# Altium project MXT2088.PrjPcb
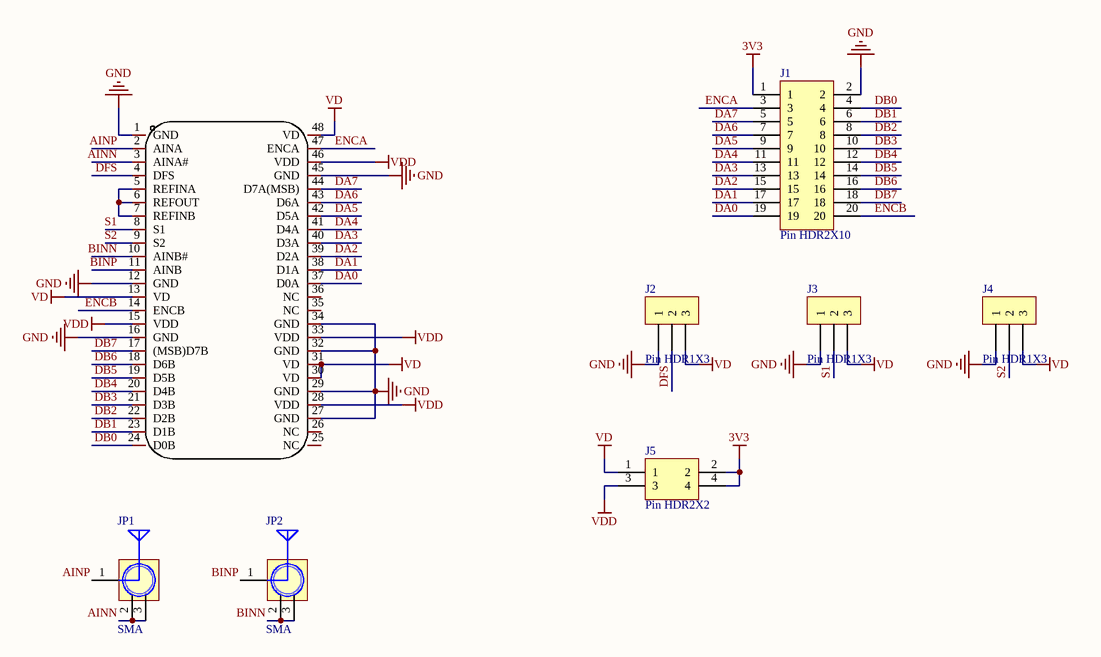
[diagram p0: MXT2088.SchDoc]
1 sheet, 8 parts. Net scope: global (net labels, ports and power ports of the same name join across sheets).
Board file: MXT2088.PcbDoc

## Sheet MXT2088.SchDoc
size A4; SheetNumber: 1; SheetTotal: 1

### Parts
J1  Pin HDR2X10  [Pin HDR2X10/2.54mm-S]
J2  Pin HDR1X3  [Pin HDR1X3/2.54mm-S]
J3  Pin HDR1X3  [Pin HDR1X3/2.54mm-S]
J4  Pin HDR1X3  [Pin HDR1X3/2.54mm-S]
J5  Pin HDR2X2  [Pin HDR2X2/2.54mm-S]
JP1  SMA  [SMA-KE]
JP2  SMA  [SMA-KE]
U1  AD9288BSTZ-40  [LQFP-48_L7.0-W7.0-P0.50-LS9.0-BL]  (value not drawn)

### Nets
3V3: J1.1 J5.2 J5.4
GND: J1.2 J2.1 J3.1 J4.1 U1.1(GND) U1.12(GND) U1.16(GND) U1.27(GND) U1.29(GND) U1.32(GND) U1.34(GND) U1.45(GND)
VD: J2.3 J3.3 J4.3 J5.1 U1.13(VD) U1.30(VD) U1.31(VD) U1.48(VD)
VDD: J5.3 U1.15(VDD) U1.28(VDD) U1.33(VDD) U1.46(VDD)
AINN: JP1.2(GND) JP1.3(GND) U1.3(AINA#)
AINP: JP1.1(ANT) U1.2(AINA)
BINN: JP2.2(GND) JP2.3(GND) U1.10(AINB#)
BINP: JP2.1(ANT) U1.11(AINB)
DA0: J1.19 U1.37(D0A)
DA1: J1.17 U1.38(D1A)
DA2: J1.15 U1.39(D2A)
DA3: J1.13 U1.40(D3A)
DA4: J1.11 U1.41(D4A)
DA5: J1.9 U1.42(D5A)
DA6: J1.7 U1.43(D6A)
DA7: J1.5 U1.44(D7A(MSB))
DB0: J1.4 U1.24(D0B)
DB1: J1.6 U1.23(D1B)
DB2: J1.8 U1.22(D2B)
DB3: J1.10 U1.21(D3B)
DB4: J1.12 U1.20(D4B)
DB5: J1.14 U1.19(D5B)
DB6: J1.16 U1.18(D6B)
DB7: J1.18 U1.17((MSB)D7B)
DFS: J2.2 U1.4(DFS)
ENCA: J1.3 U1.47(ENCA)
ENCB: J1.20 U1.14(ENCB)
S1: J3.2 U1.8(S1)
S2: J4.2 U1.9(S2)
NetU1_5: U1.5(REFINA) U1.6(REFOUT) U1.7(REFINB)

Not connected (* = marked no-connect by the designer): U1 25(NC) 26(NC) 35(NC) 36(NC)

### Library data of the parts
JP1 JP2 = SMA: SMA-2.4G射频天线接口; 版权归属: 源创客; BOM名称: SMA-2.4G射频天线接口; 学习资源: www.ooocke.com
U1 = AD9288BSTZ-40: Manufacturer: ADI(亚德诺); Add into BOM: yes; Interface: 并行; differential input: 是; number of channels: 2; sampling frequency: 40MHz; resolution: 8位; Supply Voltage: 2.7V~3.6V; Name: AD9288BSTZ-40; Symbol: AD9288BSTZ-40; Device: AD9288BSTZ-40; LCSC Part Name: AD9288BSTZ-40; Supplier Part: C653455; Manufacturer Part: AD9288BSTZ-40; Supplier Footprint: LQFP-48(7x7); JLCPCB Part Class: Extended Part; Datasheet: https://atta.szlcsc.com/upload/public/pdf/source/20140508/1457707057464.pdf; Supplier: LCSC; Convert to PCB: yes; Operating Temperature: -40℃~+85℃